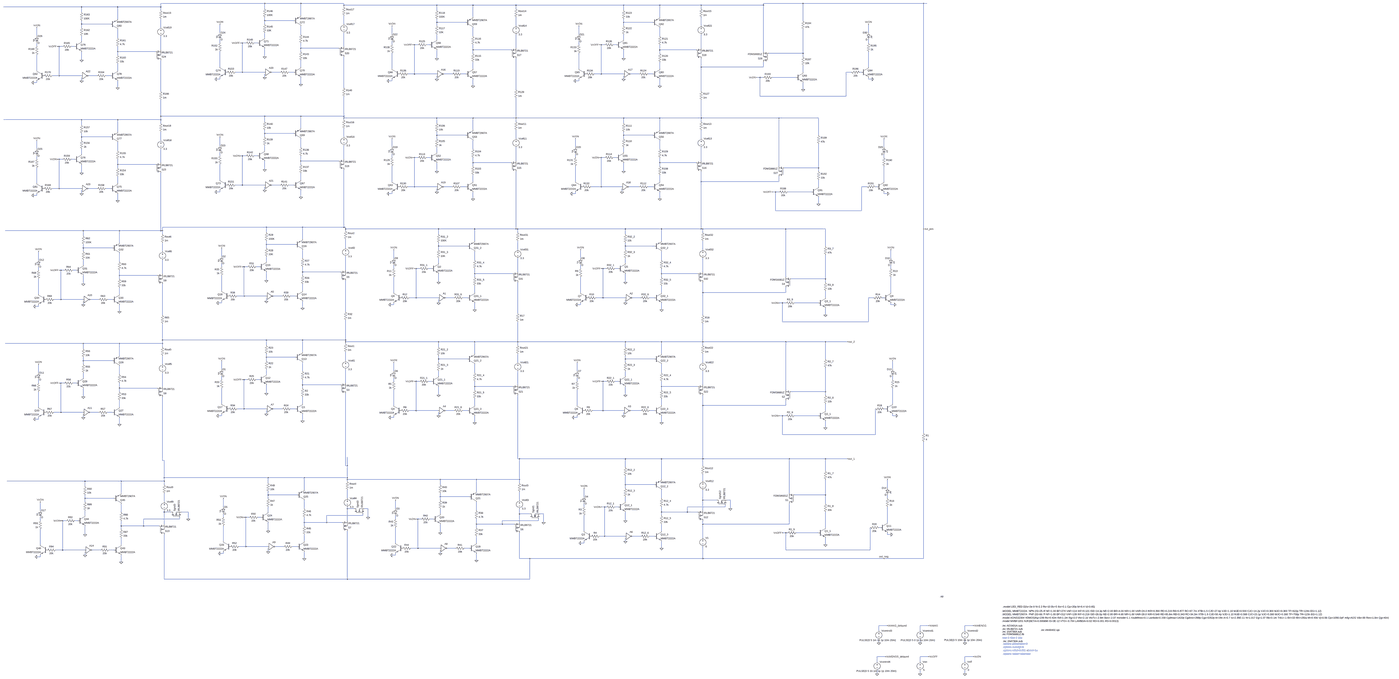
[diagram p0: schematic prueba_termica_pmos.asc, whole sheet]
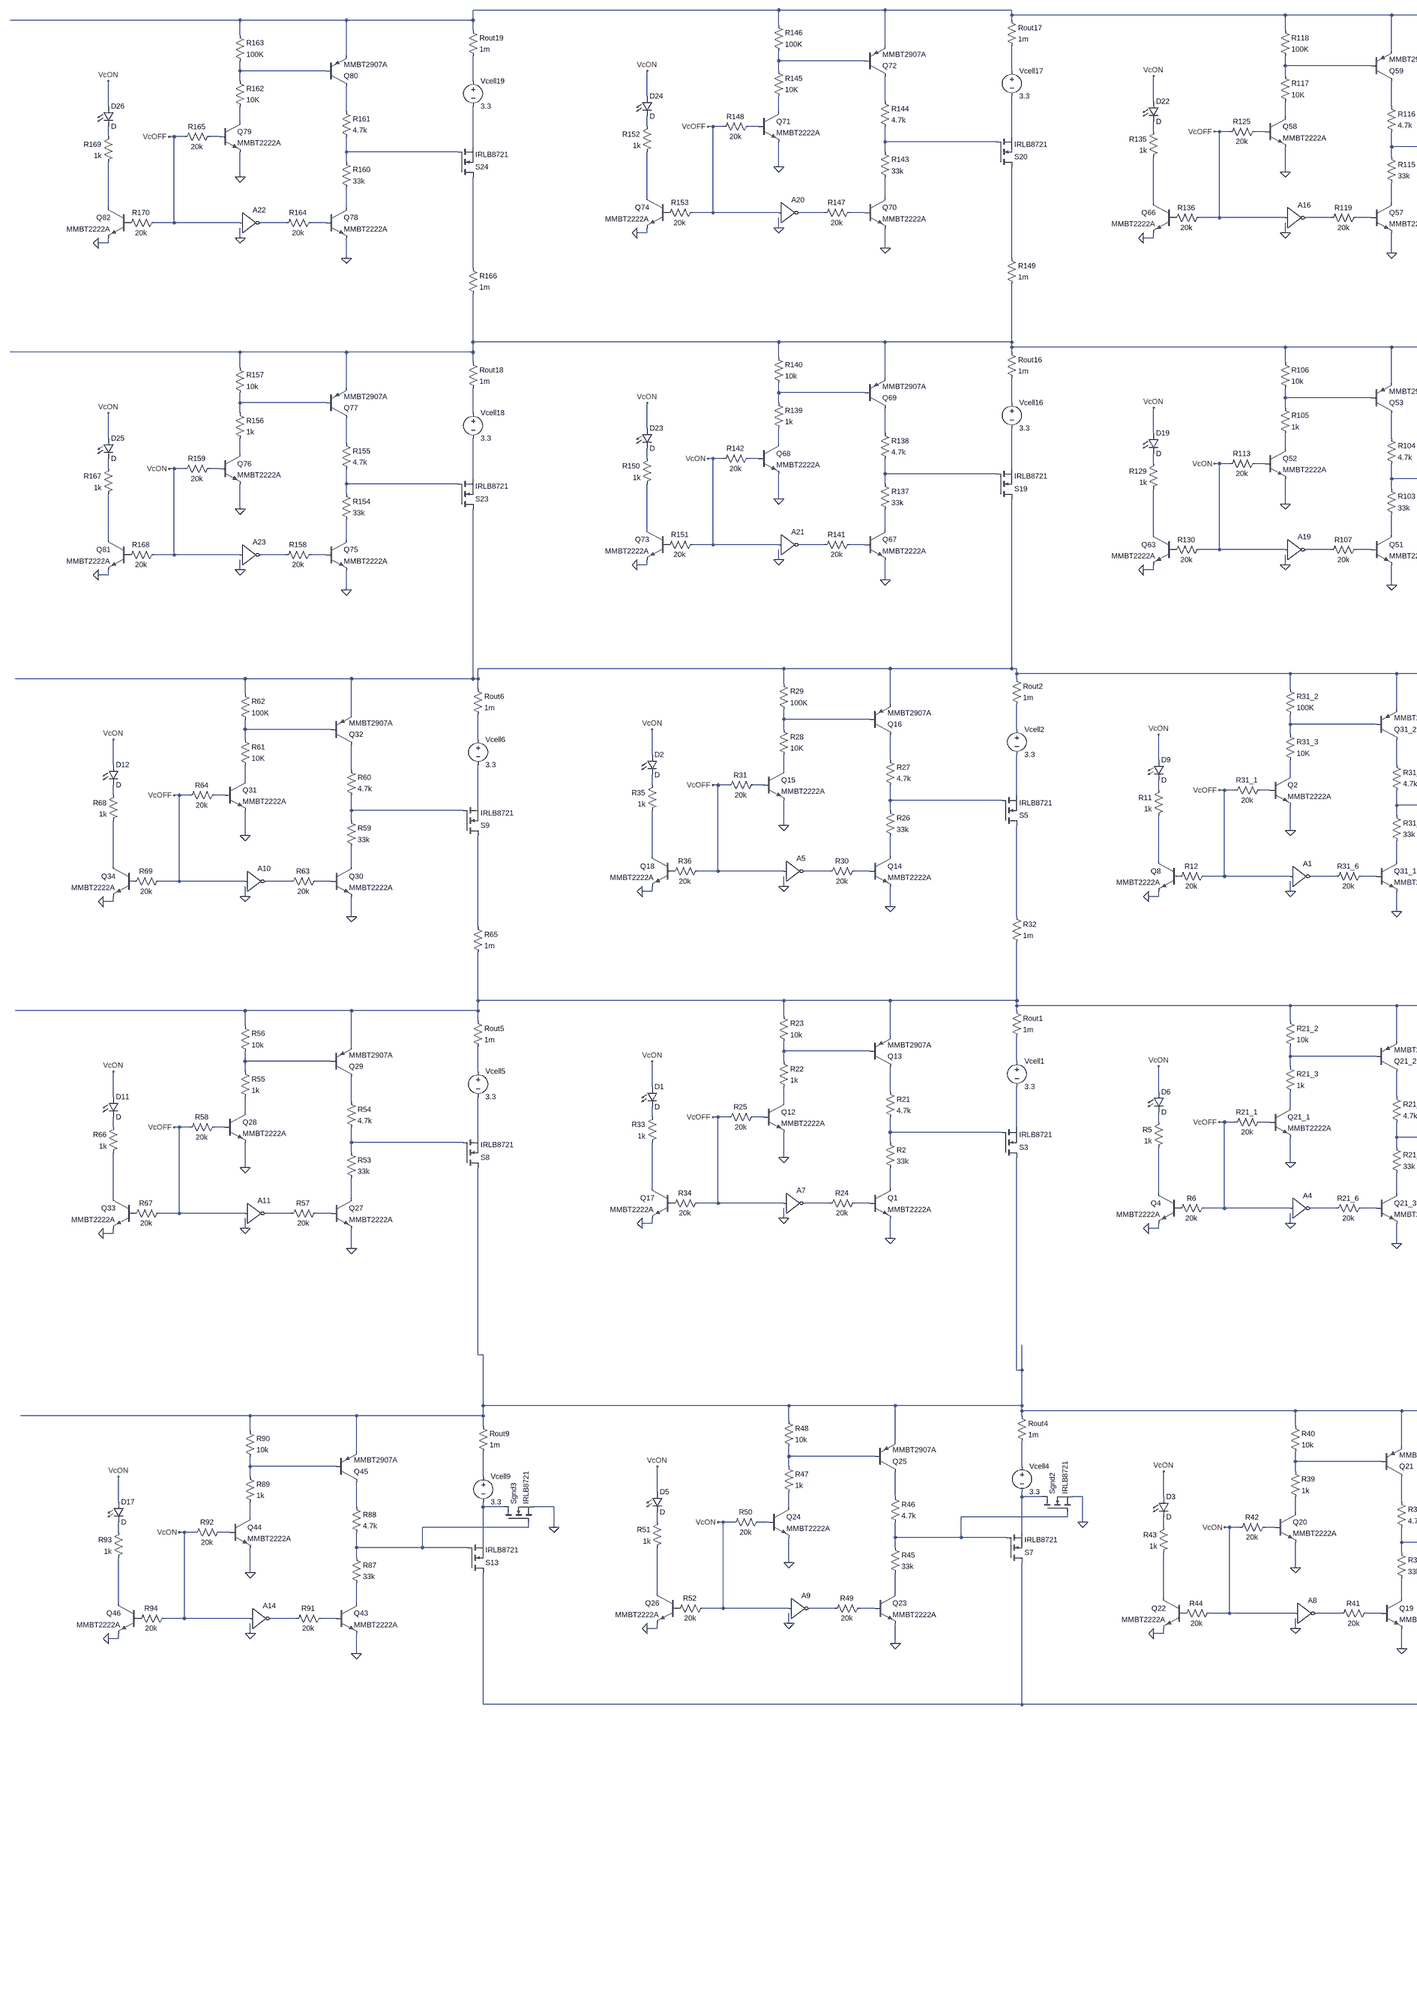
[diagram p1: schematic prueba_termica_pmos.asc, part, row 1 of 1, column 1 of 3]
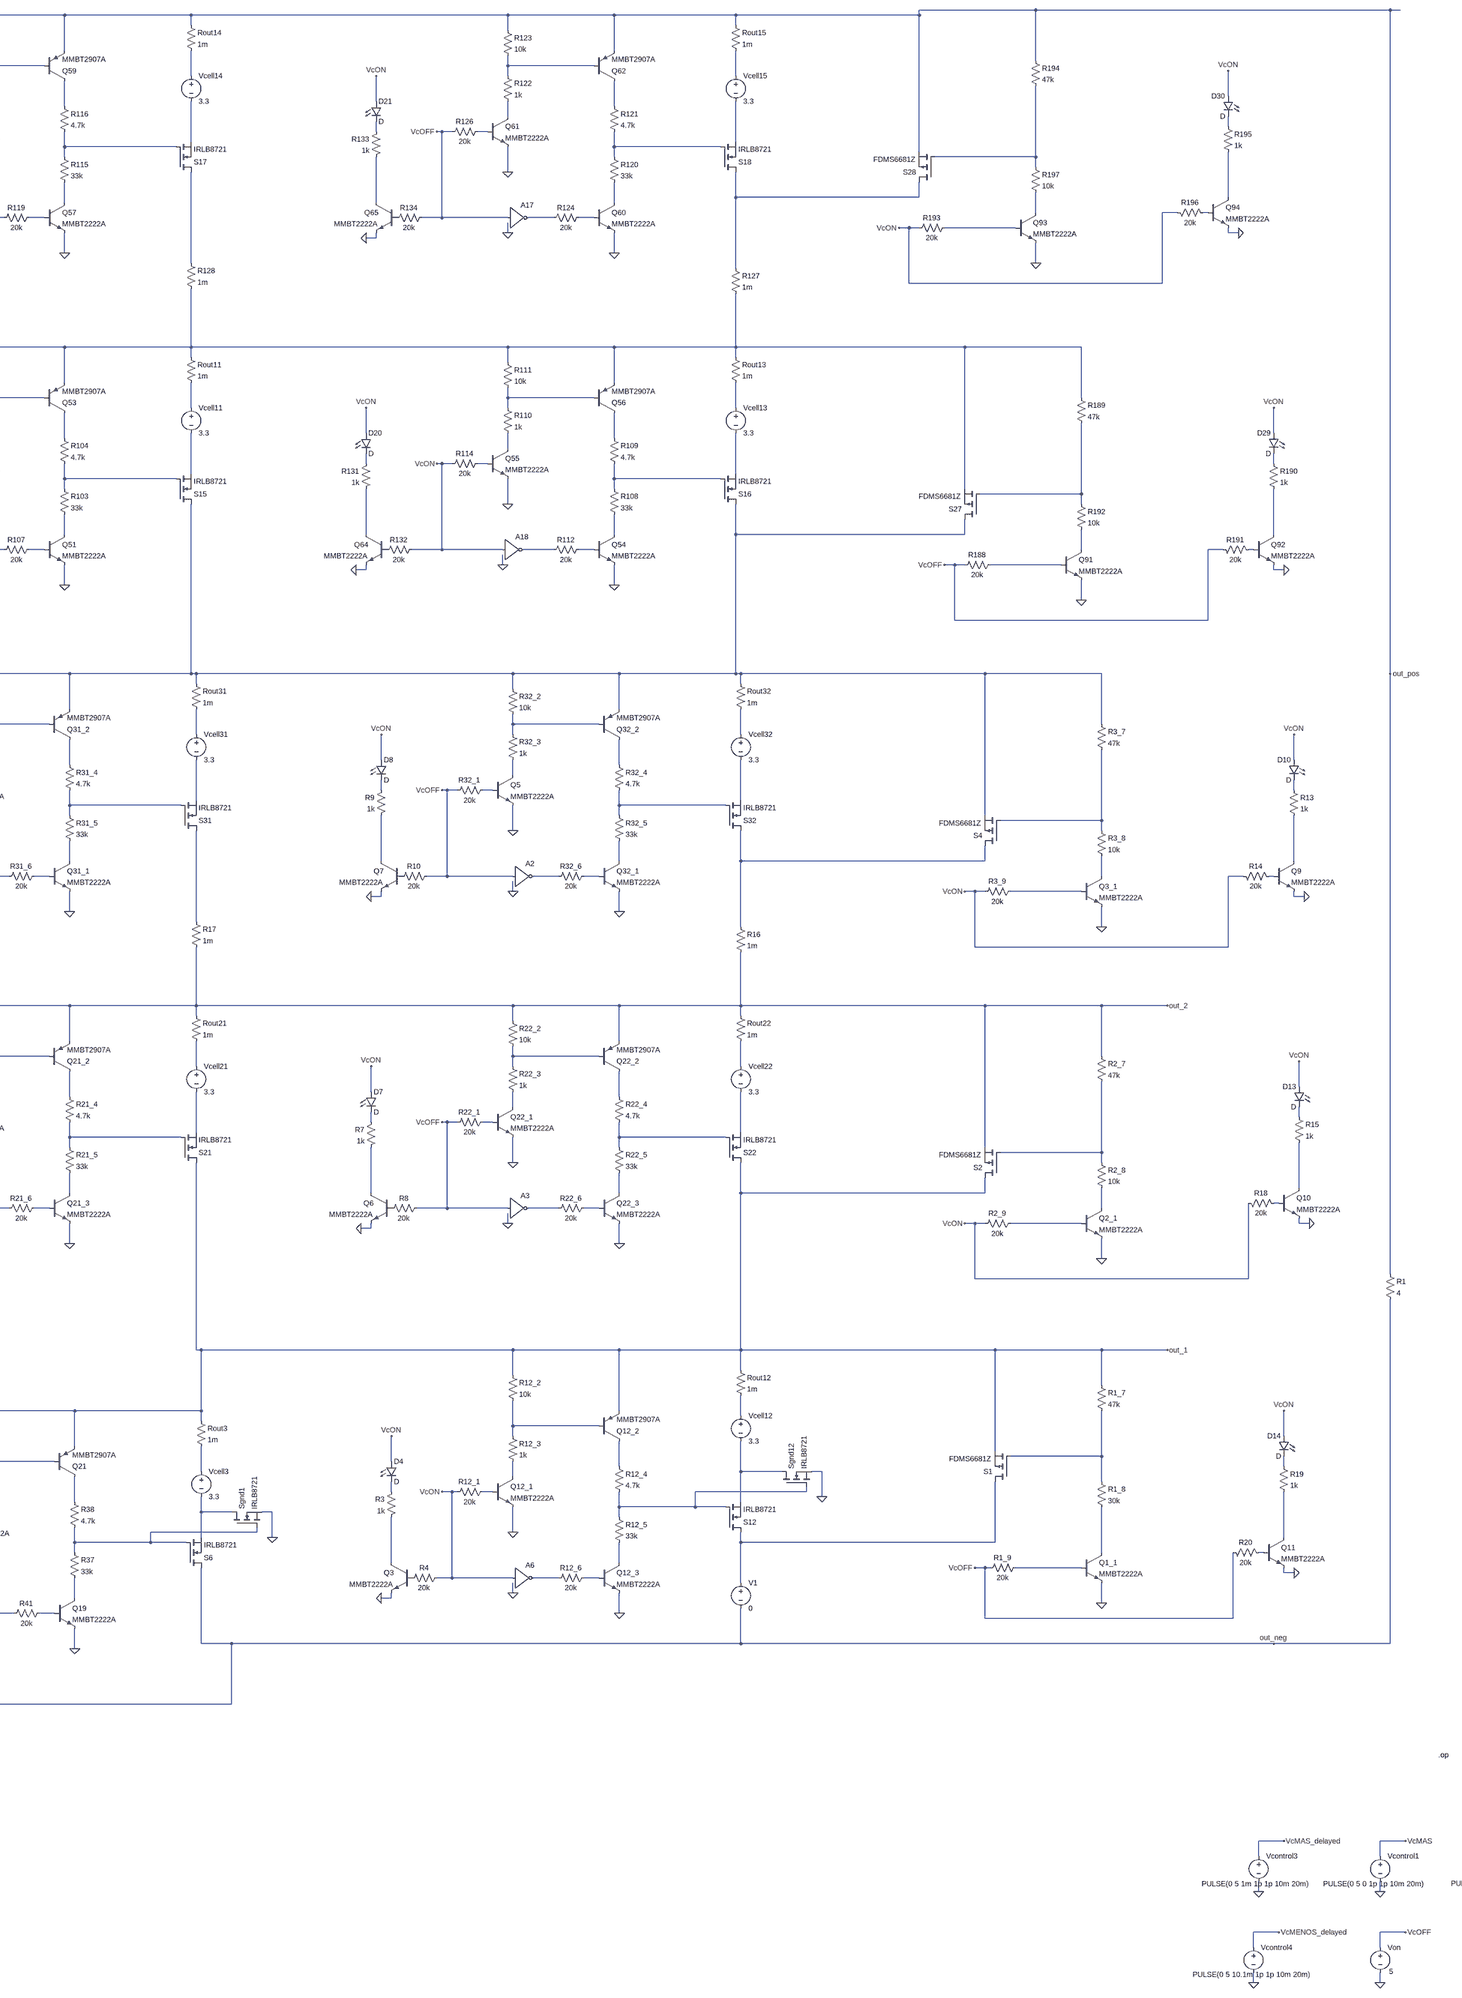
[diagram p2: schematic prueba_termica_pmos.asc, part, row 1 of 1, column 2 of 3]
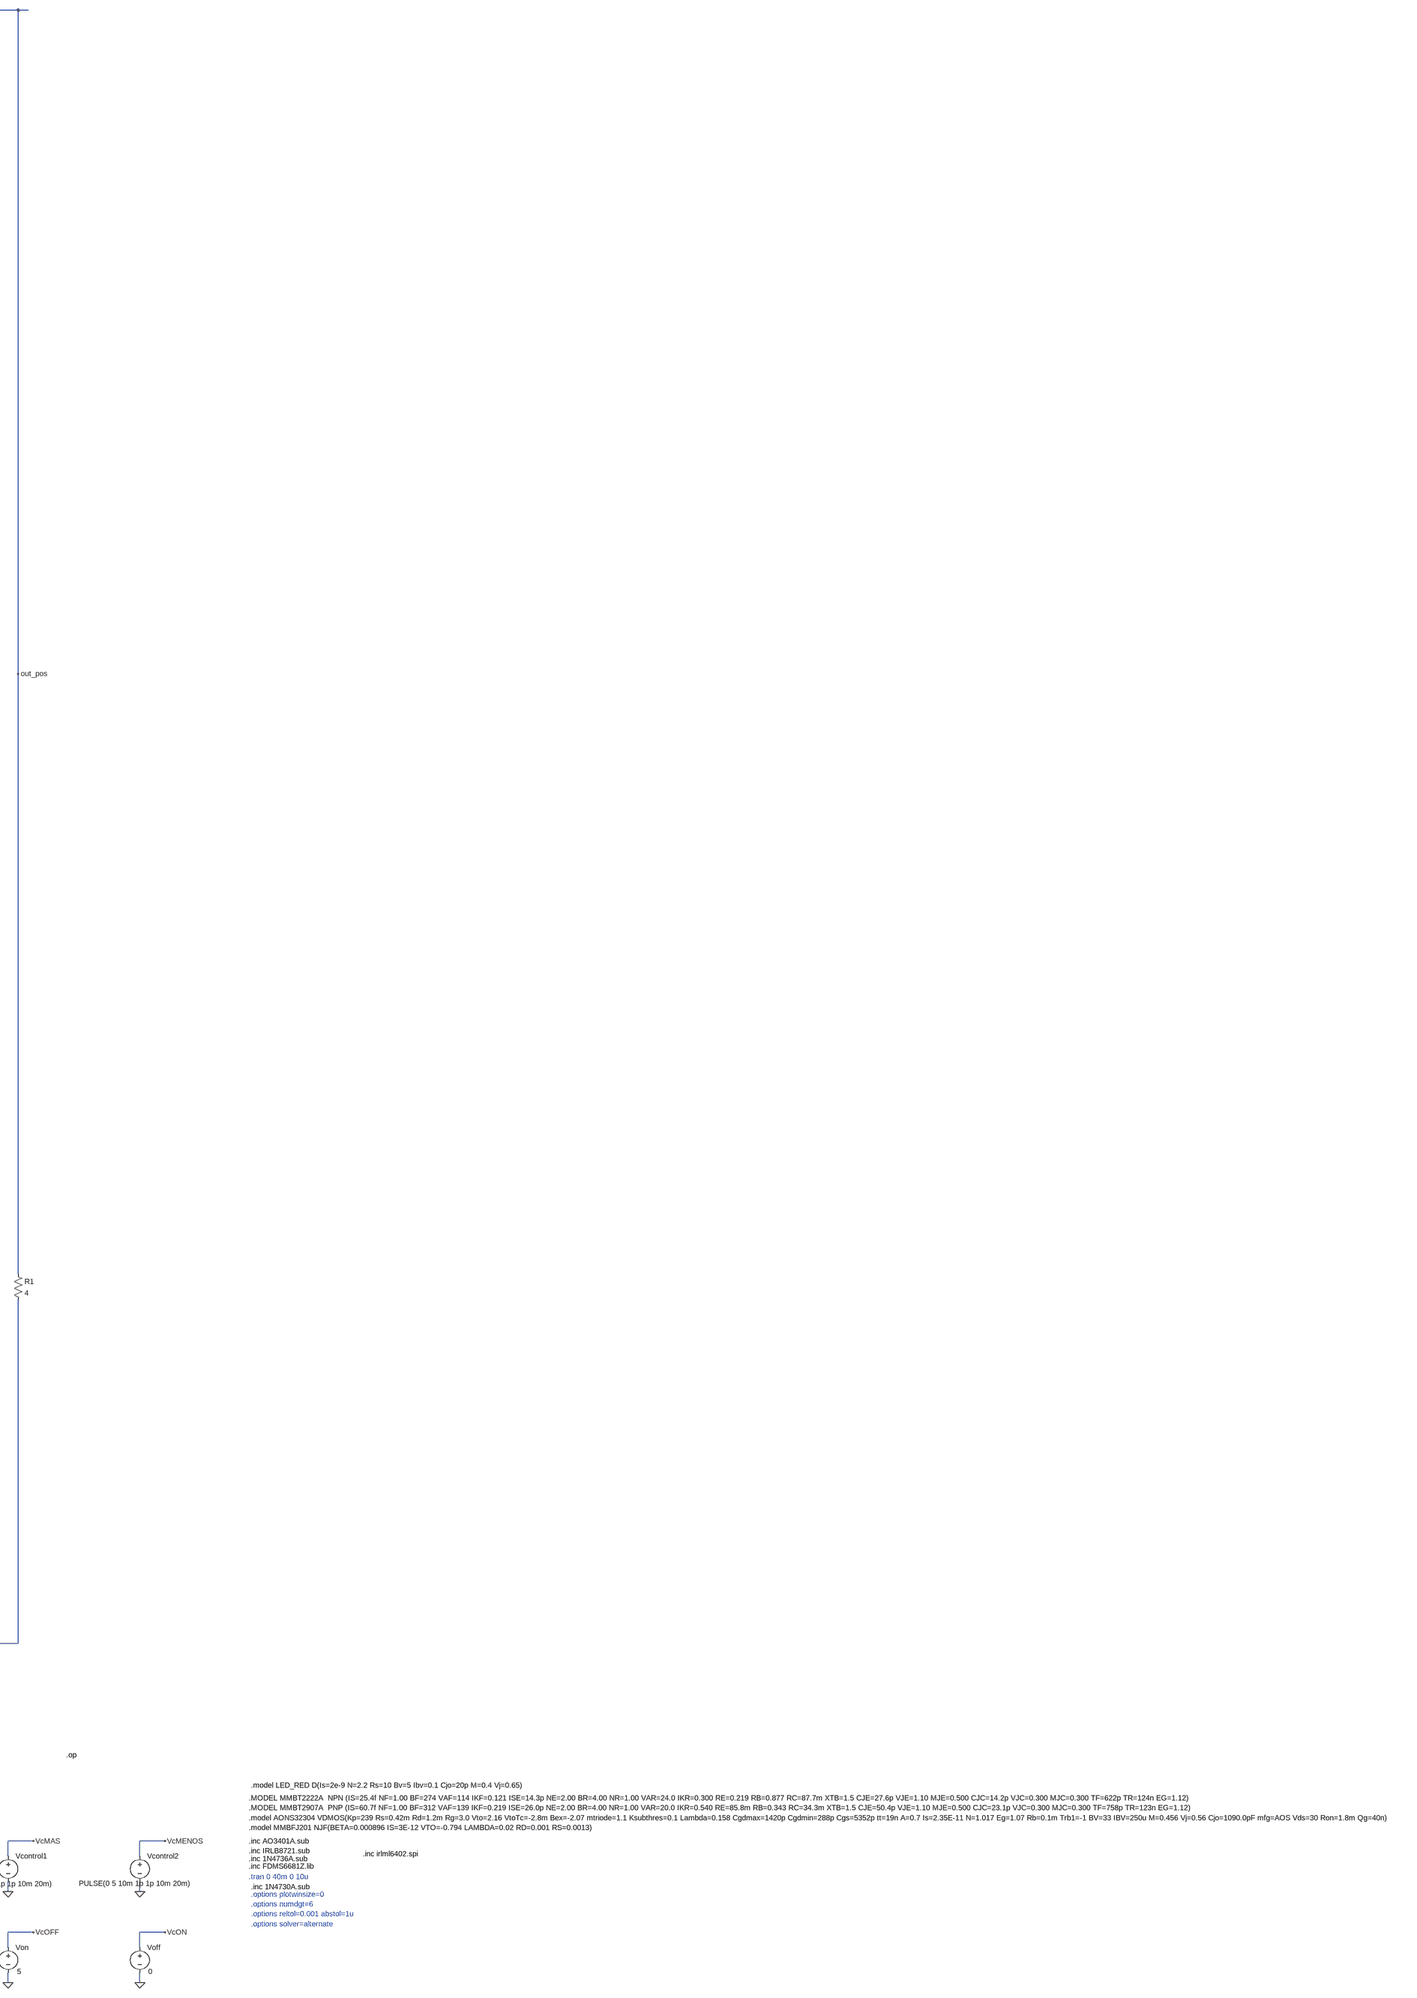
[diagram p3: schematic prueba_termica_pmos.asc, part, row 1 of 1, column 3 of 3]
* prueba_termica_pmos.asc
Q12_3 N266 N269 0 0 MMBT2222A
R12_5 N242 N266 33k
R12_4 N234 N242 4.7k
Q12_1 N239 N241 0 0 MMBT2222A
R12_3 N228 N239 1k
R12_2 out_1 N228 10k
R12_6 N269 N268 20k
Vcell12 N227 N237 3.3
Q12_2 N234 N228 out_1 0 MMBT2907A
X§S12 N262 N242 N237 IRLB8721  ; pins D G S
Q21_3 N211 N220 0 0 MMBT2222A
R21_5 N203 N211 33k
R21_4 N182 N203 4.7k
Q21_1 N186 N193 0 0 MMBT2222A
R21_3 N174 N186 1k
R21_2 out_2 N174 10k
R21_6 N220 N219 20k
Vcell21 N178 N200 3.3
Q21_2 N182 N174 out_2 0 MMBT2907A
X§S21 out_1 N203 N200 IRLB8721  ; pins D G S
Q22_3 N213 N222 0 0 MMBT2222A
R22_5 N204 N213 33k
R22_4 N183 N204 4.7k
Q22_1 N187 N195 0 0 MMBT2222A
R22_3 N175 N187 1k
R22_2 out_2 N175 10k
R22_6 N222 N221 20k
Vcell22 N179 N201 3.3
Q22_2 N183 N175 out_2 0 MMBT2907A
X§S22 out_1 N204 N201 IRLB8721  ; pins D G S
Vcontrol1 VcMAS 0 PULSE(0 5 0 1p 1p 10m 20m)
Vcontrol2 VcMENOS 0 PULSE(0 5 10m 1p 1p 10m 20m)
Voff VcON 0 0
Von VcOFF 0 5
R21_1 N193 VcOFF 20k
R22_1 N195 VcOFF 20k
R12_1 N241 VcON 20k
Rout12 out_1 N227 1m
Rout21 out_2 N178 1m
Rout22 out_2 N179 1m
Q1_1 N263 N267 0 0 MMBT2222A
R1_9 N267 VcOFF 20k
R1_7 out_1 N230 47k
Q2_1 N223 N226 0 0 MMBT2222A
R2_9 N226 VcON 20k
R2_7 out_2 N206 47k
Vcontrol3 VcMAS_delayed 0 PULSE(0 5 1m 1p 1p 10m 20m)
Vcontrol4 VcMENOS_delayed 0 PULSE(0 5 10.1m 1p 1p 10m 20m)
X§Sgnd12 N237 N242 0 IRLB8721  ; pins D G S
Q31_1 N152 N162 0 0 MMBT2222A
R31_5 N145 N152 33k
R31_4 N124 N145 4.7k
Q2 N128 N134 0 0 MMBT2222A
R31_3 N116 N128 10K
R31_2 N100 N116 100K
R31_6 N162 N161 20k
Vcell31 N120 N142 3.3
Q31_2 N124 N116 N100 0 MMBT2907A
X§S31 N171 N145 N142 IRLB8721  ; pins D G S
Q32_1 N154 N164 0 0 MMBT2222A
R32_5 N146 N154 33k
R32_4 N125 N146 4.7k
Q5 N129 N136 0 0 MMBT2222A
R32_3 N117 N129 1k
R32_2 N100 N117 10k
R32_6 N164 N163 20k
Vcell32 N121 N143 3.3
Q32_2 N125 N117 N100 0 MMBT2907A
X§S32 N155 N146 N143 IRLB8721  ; pins D G S
R31_1 N134 VcOFF 20k
R32_1 N136 VcOFF 20k
Rout31 N100 N120 1m
Rout32 N100 N121 1m
Q3_1 N165 N169 0 0 MMBT2222A
R3_9 N169 VcON 20k
R3_7 N100 N148 47k
R16 N155 out_2 1m
R17 N171 out_2 1m
A1 VcOFF 0 0 0 0 N161 0 0 BUF
A2 VcOFF 0 0 0 0 N163 0 0 BUF
A3 VcOFF 0 0 0 0 N221 0 0 BUF
A4 VcOFF 0 0 0 0 N219 0 0 BUF
A6 VcON 0 0 0 0 N268 0 0 BUF
X§S4 N155 N148 N100 FDMS6681Z  ; pins D G S
X§S2 out_1 N206 out_2 FDMS6681Z  ; pins D G S
X§S1 N262 N230 out_1 FDMS6681Z  ; pins D G S
V1 N262 out_neg 0
Q3 N265 P001 0 0 MMBT2222A
R3 N240 N265 1k
R4 VcON P001 20k
D4 VcON N240 D
Q4 N210 P002 0 0 MMBT2222A
R5 N192 N210 1k
R6 VcOFF P002 20k
D6 VcON N192 D
Q6 N212 P003 0 0 MMBT2222A
R7 N194 N212 1k
R8 VcOFF P003 20k
D7 VcON N194 D
Q7 N153 P004 0 0 MMBT2222A
R9 N135 N153 1k
R10 VcOFF P004 20k
D8 VcON N135 D
Q8 N151 P005 0 0 MMBT2222A
R11 N133 N151 1k
R12 VcOFF P005 20k
D9 VcON N133 D
Q9 N156 N166 0 0 MMBT2222A
R13 N137 N156 1k
R14 VcON N166 20k
D10 VcON N137 D
Q10 N209 N218 0 0 MMBT2222A
R15 N191 N209 1k
R18 VcON N218 20k
D13 VcON N191 D
Q11 N261 N264 0 0 MMBT2222A
R19 N235 N261 1k
R20 VcOFF N264 20k
D14 VcON N235 D
R1_8 N230 N263 30k
R2_8 N206 N223 10k
R3_8 N148 N165 10k
R1 out_pos out_neg 4
Q1 N208 N217 0 0 MMBT2222A
R2 N199 N208 33k
R21 N181 N199 4.7k
Q12 N185 N190 0 0 MMBT2222A
R22 N173 N185 1k
R23 out_2 N173 10k
R24 N217 N216 20k
Vcell1 N177 N198 3.3
Q13 N181 N173 out_2 0 MMBT2907A
X§S3 out_1 N199 N198 IRLB8721  ; pins D G S
R25 N190 VcOFF 20k
Rout1 out_2 N177 1m
Q14 N150 N160 0 0 MMBT2222A
R26 N141 N150 33k
R27 N123 N141 4.7k
Q15 N127 N132 0 0 MMBT2222A
R28 N115 N127 10K
R29 N100 N115 100K
R30 N160 N159 20k
Vcell2 N119 N140 3.3
Q16 N123 N115 N100 0 MMBT2907A
X§S5 N170 N141 N140 IRLB8721  ; pins D G S
R31 N132 VcOFF 20k
Rout2 N100 N119 1m
R32 N170 out_2 1m
A5 VcOFF 0 0 0 0 N159 0 0 BUF
A7 VcOFF 0 0 0 0 N216 0 0 BUF
Q17 N207 P006 0 0 MMBT2222A
R33 N189 N207 1k
R34 VcOFF P006 20k
D1 VcON N189 D
Q18 N149 P007 0 0 MMBT2222A
R35 N131 N149 1k
R36 VcOFF P007 20k
D2 VcON N131 D
Q19 N273 N279 0 0 MMBT2222A
R37 N260 N273 33k
R38 N245 N260 4.7k
Q20 N249 N257 0 0 MMBT2222A
R39 N231 N249 1k
R40 out_1 N231 10k
R41 N279 N278 20k
Vcell3 N236 N250 3.3
Q21 N245 N231 out_1 0 MMBT2907A
X§S6 out_neg N260 N250 IRLB8721  ; pins D G S
R42 N257 VcON 20k
Rout3 out_1 N236 1m
A8 VcON 0 0 0 0 N278 0 0 BUF
Q22 N272 P008 0 0 MMBT2222A
R43 N256 N272 1k
R44 VcON P008 20k
D3 VcON N256 D
Q23 N271 N277 0 0 MMBT2222A
R45 N252 N271 33k
R46 N243 N252 4.7k
Q24 N248 N254 0 0 MMBT2222A
R47 N229 N248 1k
R48 out_1 N229 10k
R49 N277 N276 20k
Vcell4 N233 N244 3.3
Q25 N243 N229 out_1 0 MMBT2907A
X§S7 out_neg N252 N244 IRLB8721  ; pins D G S
R50 N254 VcON 20k
Rout4 out_1 N233 1m
A9 VcON 0 0 0 0 N276 0 0 BUF
Q26 N270 P009 0 0 MMBT2222A
R51 N253 N270 1k
R52 VcON P009 20k
D5 VcON N253 D
Q27 N215 N225 0 0 MMBT2222A
R53 N205 N215 33k
R54 N184 N205 4.7k
Q28 N188 N197 0 0 MMBT2222A
R55 N176 N188 1k
R56 out_2 N176 10k
R57 N225 N224 20k
Vcell5 N180 N202 3.3
Q29 N184 N176 out_2 0 MMBT2907A
X§S8 out_1 N205 N202 IRLB8721  ; pins D G S
R58 N197 VcOFF 20k
Rout5 out_2 N180 1m
Q30 N158 N168 0 0 MMBT2222A
R59 N147 N158 33k
R60 N126 N147 4.7k
Q31 N130 N139 0 0 MMBT2222A
R61 N118 N130 10K
R62 N100 N118 100K
R63 N168 N167 20k
Vcell6 N122 N144 3.3
Q32 N126 N118 N100 0 MMBT2907A
X§S9 N172 N147 N144 IRLB8721  ; pins D G S
R64 N139 VcOFF 20k
Rout6 N100 N122 1m
R65 N172 out_2 1m
A10 VcOFF 0 0 0 0 N167 0 0 BUF
A11 VcOFF 0 0 0 0 N224 0 0 BUF
Q33 N214 P010 0 0 MMBT2222A
R66 N196 N214 1k
R67 VcOFF P010 20k
D11 VcON N196 D
Q34 N157 P011 0 0 MMBT2222A
R68 N138 N157 1k
R69 VcOFF P011 20k
D12 VcON N138 D
Q43 N275 N281 0 0 MMBT2222A
R87 N255 N275 33k
R88 N246 N255 4.7k
Q44 N251 N259 0 0 MMBT2222A
R89 N232 N251 1k
R90 out_1 N232 10k
R91 N281 N280 20k
Vcell9 N238 N247 3.3
Q45 N246 N232 out_1 0 MMBT2907A
X§S13 out_neg N255 N247 IRLB8721  ; pins D G S
R92 N259 VcON 20k
Rout9 out_1 N238 1m
A14 VcON 0 0 0 0 N280 0 0 BUF
Q46 N274 P012 0 0 MMBT2222A
R93 N258 N274 1k
R94 VcON P012 20k
D17 VcON N258 D
Q51 N097 N107 0 0 MMBT2222A
R103 N090 N097 33k
R104 N069 N090 4.7k
Q52 N073 N079 0 0 MMBT2222A
R105 N061 N073 1k
R106 N059 N061 10k
R107 N107 N106 20k
Vcell11 N065 N087 3.3
Q53 N069 N061 N059 0 MMBT2907A
X§S15 N100 N090 N087 IRLB8721  ; pins D G S
Q54 N099 N109 0 0 MMBT2222A
R108 N091 N099 33k
R109 N070 N091 4.7k
Q55 N074 N081 0 0 MMBT2222A
R110 N062 N074 1k
R111 N059 N062 10k
R112 N109 N108 20k
Vcell13 N066 N088 3.3
Q56 N070 N062 N059 0 MMBT2907A
X§S16 N100 N091 N088 IRLB8721  ; pins D G S
R113 N079 VcON 20k
R114 N081 VcON 20k
Rout11 N059 N065 1m
Rout13 N059 N066 1m
Q57 N040 N050 0 0 MMBT2222A
R115 N031 N040 33k
R116 N010 N031 4.7k
Q58 N014 N021 0 0 MMBT2222A
R117 N002 N014 10K
R118 out_pos N002 100K
R119 N050 N049 20k
Vcell14 N006 N028 3.3
Q59 N010 N002 out_pos 0 MMBT2907A
X§S17 N057 N031 N028 IRLB8721  ; pins D G S
Q60 N042 N052 0 0 MMBT2222A
R120 N032 N042 33k
R121 N011 N032 4.7k
Q61 N015 N023 0 0 MMBT2222A
R122 N003 N015 1k
R123 out_pos N003 10k
R124 N052 N051 20k
Vcell15 N007 N029 3.3
Q62 N011 N003 out_pos 0 MMBT2907A
X§S18 N037 N032 N029 IRLB8721  ; pins D G S
R125 N021 VcOFF 20k
R126 N023 VcOFF 20k
Rout14 out_pos N006 1m
Rout15 out_pos N007 1m
R127 N037 N059 1m
R128 N057 N059 1m
A16 VcOFF 0 0 0 0 N049 0 0 BUF
A17 VcOFF 0 0 0 0 N051 0 0 BUF
A18 VcON 0 0 0 0 N108 0 0 BUF
A19 VcON 0 0 0 0 N106 0 0 BUF
Q63 N096 P013 0 0 MMBT2222A
R129 N078 N096 1k
R130 VcON P013 20k
D19 VcON N078 D
Q64 N098 P014 0 0 MMBT2222A
R131 N080 N098 1k
R132 VcON P014 20k
D20 VcON N080 D
Q65 N041 P015 0 0 MMBT2222A
R133 N022 N041 1k
R134 VcOFF P015 20k
D21 VcON N022 D
Q66 N039 P016 0 0 MMBT2222A
R135 N020 N039 1k
R136 VcOFF P016 20k
D22 VcON N020 D
Q67 N095 N105 0 0 MMBT2222A
R137 N086 N095 33k
R138 N068 N086 4.7k
Q68 N072 N077 0 0 MMBT2222A
R139 N060 N072 1k
R140 N059 N060 10k
R141 N105 N104 20k
Vcell16 N064 N085 3.3
Q69 N068 N060 N059 0 MMBT2907A
X§S19 N100 N086 N085 IRLB8721  ; pins D G S
R142 N077 VcON 20k
Rout16 N059 N064 1m
Q70 N036 N046 0 0 MMBT2222A
R143 N027 N036 33k
R144 N009 N027 4.7k
Q71 N013 N018 0 0 MMBT2222A
R145 N001 N013 10K
R146 out_pos N001 100K
R147 N046 N045 20k
Vcell17 N005 N026 3.3
Q72 N009 N001 out_pos 0 MMBT2907A
X§S20 N056 N027 N026 IRLB8721  ; pins D G S
R148 N018 VcOFF 20k
Rout17 out_pos N005 1m
R149 N056 N059 1m
A20 VcOFF 0 0 0 0 N045 0 0 BUF
A21 VcON 0 0 0 0 N104 0 0 BUF
Q73 N094 P017 0 0 MMBT2222A
R150 N076 N094 1k
R151 VcON P017 20k
D23 VcON N076 D
Q74 N035 P018 0 0 MMBT2222A
R152 N017 N035 1k
R153 VcOFF P018 20k
D24 VcON N017 D
Q75 N103 N113 0 0 MMBT2222A
R154 N092 N103 33k
R155 N071 N092 4.7k
Q76 N075 N084 0 0 MMBT2222A
R156 N063 N075 1k
R157 N059 N063 10k
R158 N113 N112 20k
Vcell18 N067 N089 3.3
Q77 N071 N063 N059 0 MMBT2907A
X§S23 N100 N092 N089 IRLB8721  ; pins D G S
R159 N084 VcON 20k
Rout18 N059 N067 1m
Q78 N044 N054 0 0 MMBT2222A
R160 N033 N044 33k
R161 N012 N033 4.7k
Q79 N016 N025 0 0 MMBT2222A
R162 N004 N016 10K
R163 out_pos N004 100K
R164 N054 N053 20k
Vcell19 N008 N030 3.3
Q80 N012 N004 out_pos 0 MMBT2907A
X§S24 N058 N033 N030 IRLB8721  ; pins D G S
R165 N025 VcOFF 20k
Rout19 out_pos N008 1m
R166 N058 N059 1m
A22 VcOFF 0 0 0 0 N053 0 0 BUF
A23 VcON 0 0 0 0 N112 0 0 BUF
Q81 N102 P019 0 0 MMBT2222A
R167 N083 N102 1k
R168 VcON P019 20k
D25 VcON N083 D
Q82 N043 P020 0 0 MMBT2222A
R169 N024 N043 1k
R170 VcOFF P020 20k
D26 VcON N024 D
Q91 N110 N114 0 0 MMBT2222A
R188 N114 VcOFF 20k
R189 N059 N093 47k
X§S27 N100 N093 N059 FDMS6681Z  ; pins D G S
Q92 N101 N111 0 0 MMBT2222A
R190 N082 N101 1k
R191 VcOFF N111 20k
D29 VcON N082 D
R192 N093 N110 10k
Q93 N047 N055 0 0 MMBT2222A
R193 N055 VcON 20k
R194 out_pos N034 47k
X§S28 N037 N034 out_pos FDMS6681Z  ; pins D G S
Q94 N038 N048 0 0 MMBT2222A
R195 N019 N038 1k
R196 VcON N048 20k
D30 VcON N019 D
R197 N034 N047 10k
X§Sgnd1 N250 N260 0 IRLB8721  ; pins D G S
X§Sgnd2 N244 N252 0 IRLB8721  ; pins D G S
X§Sgnd3 N247 N255 0 IRLB8721  ; pins D G S
.model D D
.lib standard.dio
.model NPN NPN
.model PNP PNP
.lib standard.bjt
* .tran 0 40m 0 10u
.MODEL MMBT2222A  NPN (IS=25.4f NF=1.00 BF=274 VAF=114 IKF=0.121 ISE=14.3p NE=2.00 BR=4.00 NR=1.00 VAR=24.0 IKR=0.300 RE=0.219 RB=0.877 RC=87.7m XTB=1.5 CJE=27.6p VJE=1.10 MJE=0.500 CJC=14.2p VJC=0.300 MJC=0.300 TF=622p TR=124n EG=1.12)
.MODEL MMBT2907A  PNP (IS=60.7f NF=1.00 BF=312 VAF=139 IKF=0.219 ISE=26.0p NE=2.00 BR=4.00 NR=1.00 VAR=20.0 IKR=0.540 RE=85.8m RB=0.343 RC=34.3m XTB=1.5 CJE=50.4p VJE=1.10 MJE=0.500 CJC=23.1p VJC=0.300 MJC=0.300 TF=758p TR=123n EG=1.12)
.model AONS32304 VDMOS(Kp=239 Rs=0.42m Rd=1.2m Rg=3.0 Vto=2.16 VtoTc=-2.8m Bex=-2.07 mtriode=1.1 Ksubthres=0.1 Lambda=0.158 Cgdmax=1420p Cgdmin=288p Cgs=5352p tt=19n A=0.7 Is=2.35E-11 N=1.017 Eg=1.07 Rb=0.1m Trb1=-1 BV=33 IBV=250u M=0.456 Vj=0.56 Cjo=1090.0pF mfg=AOS Vds=30 Ron=1.8m Qg=40n)
.model MMBFJ201 NJF(BETA=0.000896 IS=3E-12 VTO=-0.794 LAMBDA=0.02 RD=0.001 RS=0.0013)
.inc AO3401A.sub
.inc IRLB8721.sub
.inc 1N4736A.sub
* .options plotwinsize=0
* .options numdgt=6
* .options reltol=0.001 abstol=1u
* .options solver=alternate
.inc FDMS6681Z.lib
.inc 1N4730A.sub
.model LED_RED D(Is=2e-9 N=2.2 Rs=10 Bv=5 Ibv=0.1 Cjo=20p M=0.4 Vj=0.65)
.op
.inc irlml6402.spi
.backanno
.end